# EAGLE design Power Supply Board (EAGLE 7.5.0)
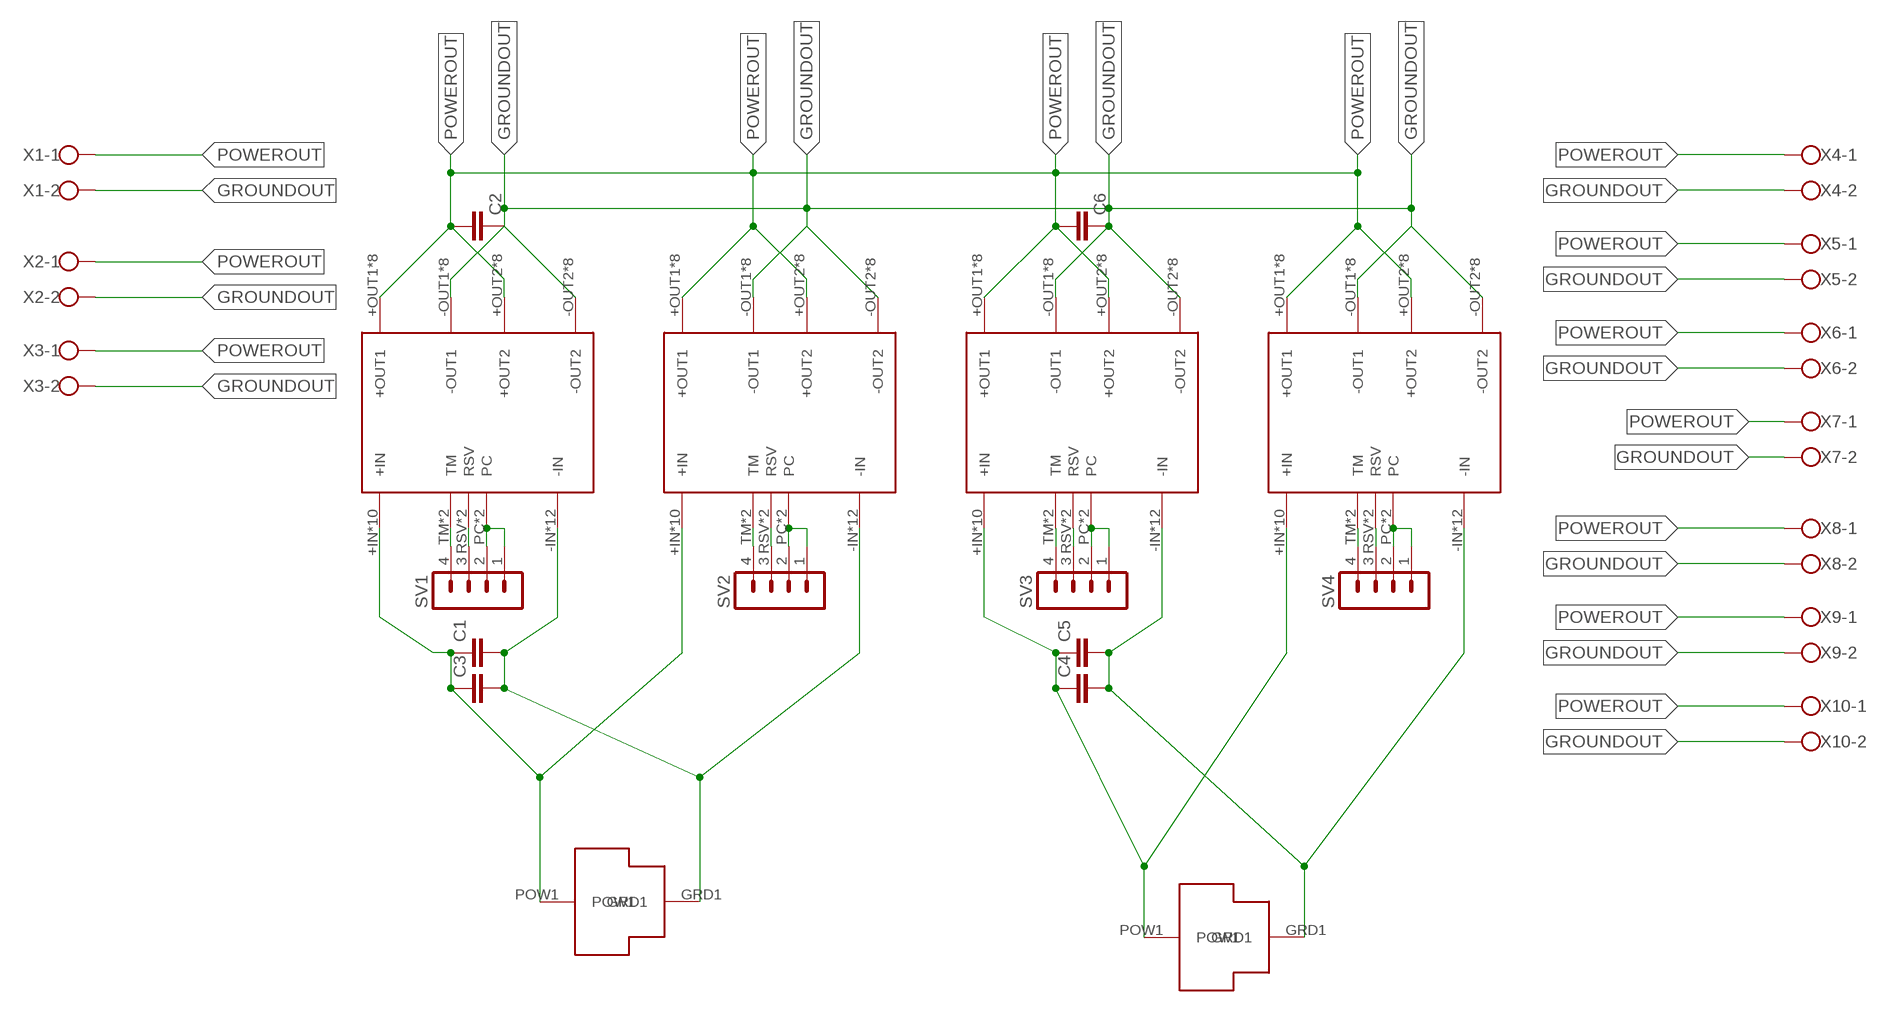
[diagram p0: schematic, sheet 1]

## Parts
C1  C2,5-3  [C2.5-3]
C2  C2,5-3  [C2.5-3]
C3  C2,5-3  [C2.5-3]
C4  C2,5-3  [C2.5-3]
C5  C2,5-3  [C2.5-3]
C6  C2,5-3  [C2.5-3]
SV1  MA04-1  [MA04-1]
SV2  MA04-1  [MA04-1]
SV3  MA04-1  [MA04-1]
SV4  MA04-1  [MA04-1]
U$3  MOLEXMEGAFIT  [MOLEXMEGAFIT]
U$9  MOLEXMEGAFIT  [MOLEXMEGAFIT]
VC1  VOLTAGECONVERTER  [VOLTAGECONVERTER]
VC2  VOLTAGECONVERTER  [VOLTAGECONVERTER]
VC3  VOLTAGECONVERTER  [VOLTAGECONVERTER]
VC4  VOLTAGECONVERTER  [VOLTAGECONVERTER]
X1  W237-102  [W237-102]
X2  W237-102  [W237-102]
X3  W237-102  [W237-102]
X4  W237-102  [W237-102]
X5  W237-102  [W237-102]
X6  W237-102  [W237-102]
X7  W237-102  [W237-102]
X8  W237-102  [W237-102]
X9  W237-102  [W237-102]
X10  W237-102  [W237-102]

## Nets
GROUNDIN: C1.2 C3.2 C4.2 C5.2 U$3.GRD1 U$9.GRD1 VC1.-IN VC1.-IN@0(-IN) VC1.-IN@1(-IN) VC1.-IN@2(-IN) VC1.-IN@3(-IN) VC1.-IN@4(-IN) VC1.-IN@5(-IN) VC1.-IN@6(-IN) VC1.-IN@7(-IN) VC1.-IN@8(-IN) VC1.-IN@9(-IN) VC1.-IN@10(-IN) VC2.-IN VC2.-IN@0(-IN) VC2.-IN@1(-IN) VC2.-IN@2(-IN) VC2.-IN@3(-IN) VC2.-IN@4(-IN) VC2.-IN@5(-IN) VC2.-IN@6(-IN) VC2.-IN@7(-IN) VC2.-IN@8(-IN) VC2.-IN@9(-IN) VC2.-IN@10(-IN) VC3.-IN VC3.-IN@0(-IN) VC3.-IN@1(-IN) VC3.-IN@2(-IN) VC3.-IN@3(-IN) VC3.-IN@4(-IN) VC3.-IN@5(-IN) VC3.-IN@6(-IN) VC3.-IN@7(-IN) VC3.-IN@8(-IN) VC3.-IN@9(-IN) VC3.-IN@10(-IN) VC4.-IN VC4.-IN@0(-IN) VC4.-IN@1(-IN) VC4.-IN@2(-IN) VC4.-IN@3(-IN) VC4.-IN@4(-IN) VC4.-IN@5(-IN) VC4.-IN@6(-IN) VC4.-IN@7(-IN) VC4.-IN@8(-IN) VC4.-IN@9(-IN) VC4.-IN@10(-IN)
GROUNDOUT: C2.1 C6.1 VC1.-OUT1 VC1.-OUT1@1(-OUT1) VC1.-OUT1@2(-OUT1) VC1.-OUT1@3(-OUT1) VC1.-OUT1@4(-OUT1) VC1.-OUT1@5(-OUT1) VC1.-OUT1@6(-OUT1) VC1.-OUT1@7(-OUT1) VC1.-OUT2 VC1.-OUT2@1(-OUT2) VC1.-OUT2@2(-OUT2) VC1.-OUT2@3(-OUT2) VC1.-OUT2@4(-OUT2) VC1.-OUT2@5(-OUT2) VC1.-OUT2@6(-OUT2) VC1.-OUT2@7(-OUT2) VC2.-OUT1 VC2.-OUT1@1(-OUT1) VC2.-OUT1@2(-OUT1) VC2.-OUT1@3(-OUT1) VC2.-OUT1@4(-OUT1) VC2.-OUT1@5(-OUT1) VC2.-OUT1@6(-OUT1) VC2.-OUT1@7(-OUT1) VC2.-OUT2 VC2.-OUT2@1(-OUT2) VC2.-OUT2@2(-OUT2) VC2.-OUT2@3(-OUT2) VC2.-OUT2@4(-OUT2) VC2.-OUT2@5(-OUT2) VC2.-OUT2@6(-OUT2) VC2.-OUT2@7(-OUT2) VC3.-OUT1 VC3.-OUT1@1(-OUT1) VC3.-OUT1@2(-OUT1) VC3.-OUT1@3(-OUT1) VC3.-OUT1@4(-OUT1) VC3.-OUT1@5(-OUT1) VC3.-OUT1@6(-OUT1) VC3.-OUT1@7(-OUT1) VC3.-OUT2 VC3.-OUT2@1(-OUT2) VC3.-OUT2@2(-OUT2) VC3.-OUT2@3(-OUT2) VC3.-OUT2@4(-OUT2) VC3.-OUT2@5(-OUT2) VC3.-OUT2@6(-OUT2) VC3.-OUT2@7(-OUT2) VC4.-OUT1 VC4.-OUT1@1(-OUT1) VC4.-OUT1@2(-OUT1) VC4.-OUT1@3(-OUT1) VC4.-OUT1@4(-OUT1) VC4.-OUT1@5(-OUT1) VC4.-OUT1@6(-OUT1) VC4.-OUT1@7(-OUT1) VC4.-OUT2 VC4.-OUT2@1(-OUT2) VC4.-OUT2@2(-OUT2) VC4.-OUT2@3(-OUT2) VC4.-OUT2@4(-OUT2) VC4.-OUT2@5(-OUT2) VC4.-OUT2@6(-OUT2) VC4.-OUT2@7(-OUT2) X1.2 X2.2 X3.2 X4.2 X5.2 X6.2 X7.2 X8.2 X9.2 X10.2
N$2: SV1.3 VC1.RSV VC1.RSV@1(RSV)
N$5: SV2.3 VC2.RSV VC2.RSV@1(RSV)
N$8: SV3.3 VC3.RSV VC3.RSV@1(RSV)
N$11: SV4.3 VC4.RSV VC4.RSV@1(RSV)
PC1: SV1.1 SV1.2 VC1.PC VC1.PC21(PC)
PC2: SV2.1 SV2.2 VC2.PC VC2.PC21(PC)
PC3: SV3.1 SV3.2 VC3.PC VC3.PC21(PC)
PC4: SV4.1 SV4.2 VC4.PC VC4.PC21(PC)
POWERIN12: C1.1 C3.1 U$3.POW1 VC1.+IN VC1.+IN@1(+IN) VC1.+IN@2(+IN) VC1.+IN@3(+IN) VC1.+IN@4(+IN) VC1.+IN@5(+IN) VC1.+IN@6(+IN) VC1.+IN@7(+IN) VC1.+IN@8(+IN) VC1.+IN@9(+IN) VC2.+IN VC2.+IN@1(+IN) VC2.+IN@2(+IN) VC2.+IN@3(+IN) VC2.+IN@4(+IN) VC2.+IN@5(+IN) VC2.+IN@6(+IN) VC2.+IN@7(+IN) VC2.+IN@8(+IN) VC2.+IN@9(+IN)
POWERIN34: C4.1 C5.1 U$9.POW1 VC3.+IN VC3.+IN@1(+IN) VC3.+IN@2(+IN) VC3.+IN@3(+IN) VC3.+IN@4(+IN) VC3.+IN@5(+IN) VC3.+IN@6(+IN) VC3.+IN@7(+IN) VC3.+IN@8(+IN) VC3.+IN@9(+IN) VC4.+IN VC4.+IN@1(+IN) VC4.+IN@2(+IN) VC4.+IN@3(+IN) VC4.+IN@4(+IN) VC4.+IN@5(+IN) VC4.+IN@6(+IN) VC4.+IN@7(+IN) VC4.+IN@8(+IN) VC4.+IN@9(+IN)
POWEROUT: C2.2 C6.2 VC1.+OUT1 VC1.+OUT1@1(+OUT1) VC1.+OUT1@2(+OUT1) VC1.+OUT1@3(+OUT1) VC1.+OUT1@4(+OUT1) VC1.+OUT1@5(+OUT1) VC1.+OUT1@6(+OUT1) VC1.+OUT1@7(+OUT1) VC1.+OUT2 VC1.+OUT2@1(+OUT2) VC1.+OUT2@2(+OUT2) VC1.+OUT2@3(+OUT2) VC1.+OUT2@4(+OUT2) VC1.+OUT2@5(+OUT2) VC1.+OUT2@6(+OUT2) VC1.+OUT2@7(+OUT2) VC2.+OUT1 VC2.+OUT1@1(+OUT1) VC2.+OUT1@2(+OUT1) VC2.+OUT1@3(+OUT1) VC2.+OUT1@4(+OUT1) VC2.+OUT1@5(+OUT1) VC2.+OUT1@6(+OUT1) VC2.+OUT1@7(+OUT1) VC2.+OUT2 VC2.+OUT2@1(+OUT2) VC2.+OUT2@2(+OUT2) VC2.+OUT2@3(+OUT2) VC2.+OUT2@4(+OUT2) VC2.+OUT2@5(+OUT2) VC2.+OUT2@6(+OUT2) VC2.+OUT2@7(+OUT2) VC3.+OUT1 VC3.+OUT1@1(+OUT1) VC3.+OUT1@2(+OUT1) VC3.+OUT1@3(+OUT1) VC3.+OUT1@4(+OUT1) VC3.+OUT1@5(+OUT1) VC3.+OUT1@6(+OUT1) VC3.+OUT1@7(+OUT1) VC3.+OUT2 VC3.+OUT2@1(+OUT2) VC3.+OUT2@2(+OUT2) VC3.+OUT2@3(+OUT2) VC3.+OUT2@4(+OUT2) VC3.+OUT2@5(+OUT2) VC3.+OUT2@6(+OUT2) VC3.+OUT2@7(+OUT2) VC4.+OUT1 VC4.+OUT1@1(+OUT1) VC4.+OUT1@2(+OUT1) VC4.+OUT1@3(+OUT1) VC4.+OUT1@4(+OUT1) VC4.+OUT1@5(+OUT1) VC4.+OUT1@6(+OUT1) VC4.+OUT1@7(+OUT1) VC4.+OUT2 VC4.+OUT2@1(+OUT2) VC4.+OUT2@2(+OUT2) VC4.+OUT2@3(+OUT2) VC4.+OUT2@4(+OUT2) VC4.+OUT2@5(+OUT2) VC4.+OUT2@6(+OUT2) VC4.+OUT2@7(+OUT2) X1.1 X2.1 X3.1 X4.1 X5.1 X6.1 X7.1 X8.1 X9.1 X10.1
TM1: SV1.4 VC1.TM VC1.TM@1(TM)
TM2: SV2.4 VC2.TM VC2.TM@1(TM)
TM3: SV3.4 VC3.TM VC3.TM@1(TM)
TM4: SV4.4 VC4.TM VC4.TM@1(TM)

## Library data of the parts
C1-C6 = capacitor-wima:C: CAPACITOR naming: grid - package width
SV1-SV4 = con-lstb:MA04-1: PIN HEADER; OC_FARNELL: unknown; OC_NEWARK: unknown
U$3 U$9 = MolexMegaFIT 2circuit:MOLEXMEGAFIT
VC1-VC4 = Voltage Converter Pins:VOLTAGECONVERTER
X1-X10 = con-wago-500:W237-102: WAGO SCREW CLAMP; MPN: 237-102; OC_FARNELL: unknown; OC_NEWARK: 70K9898

## Board
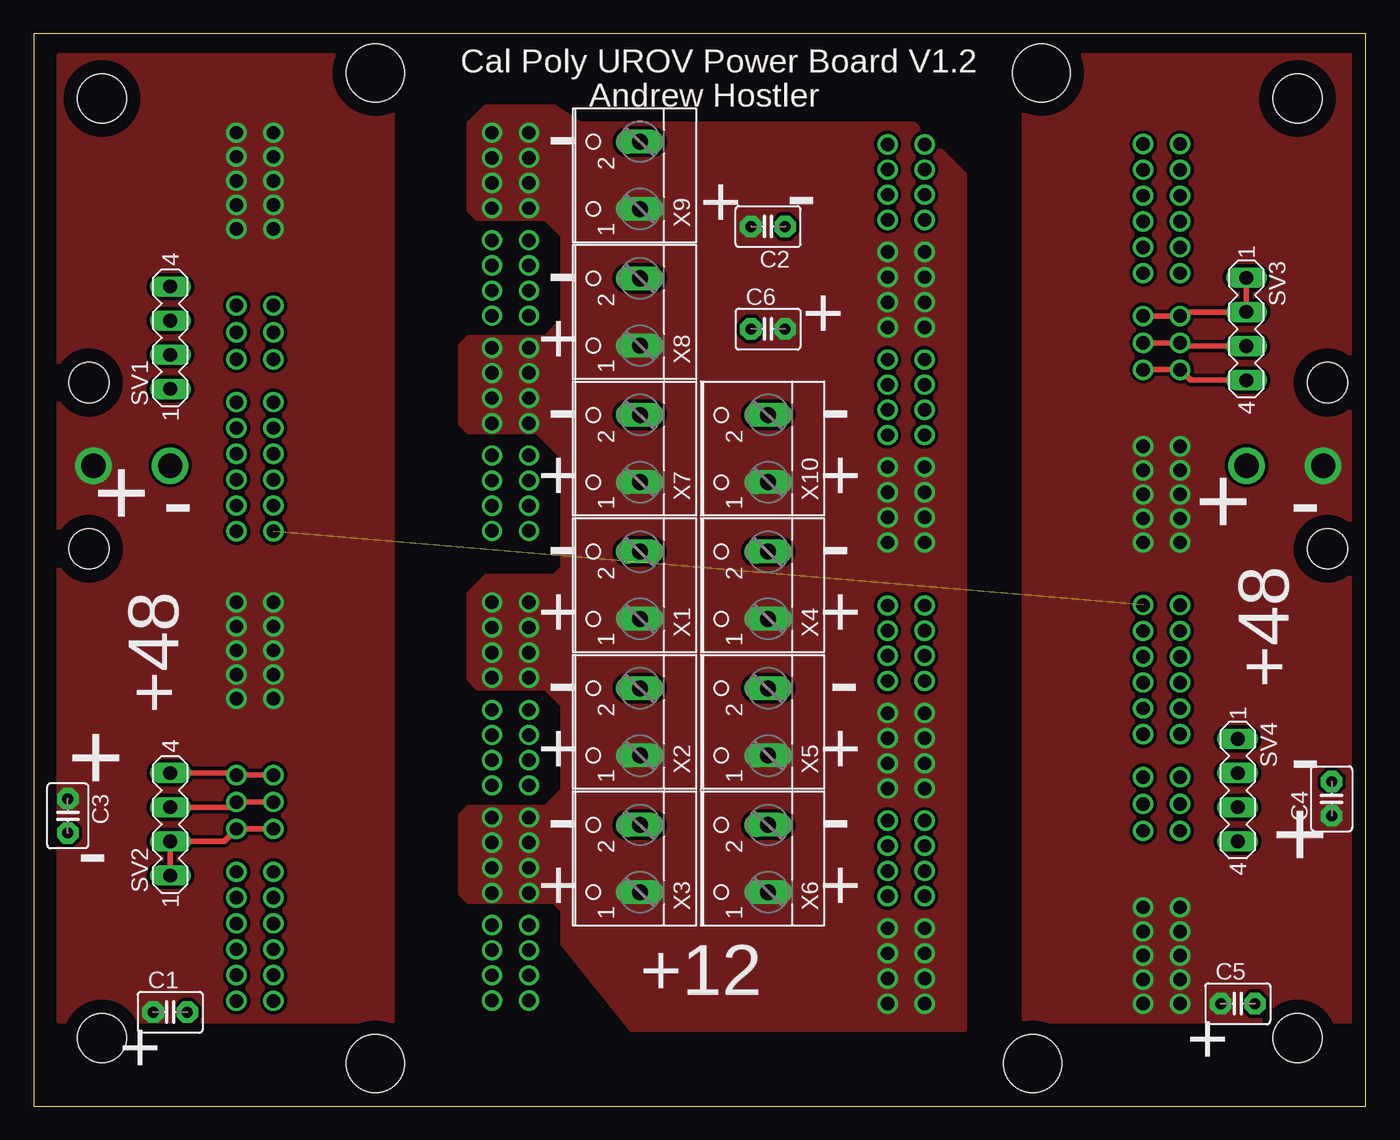
[diagram p1: board, top side]
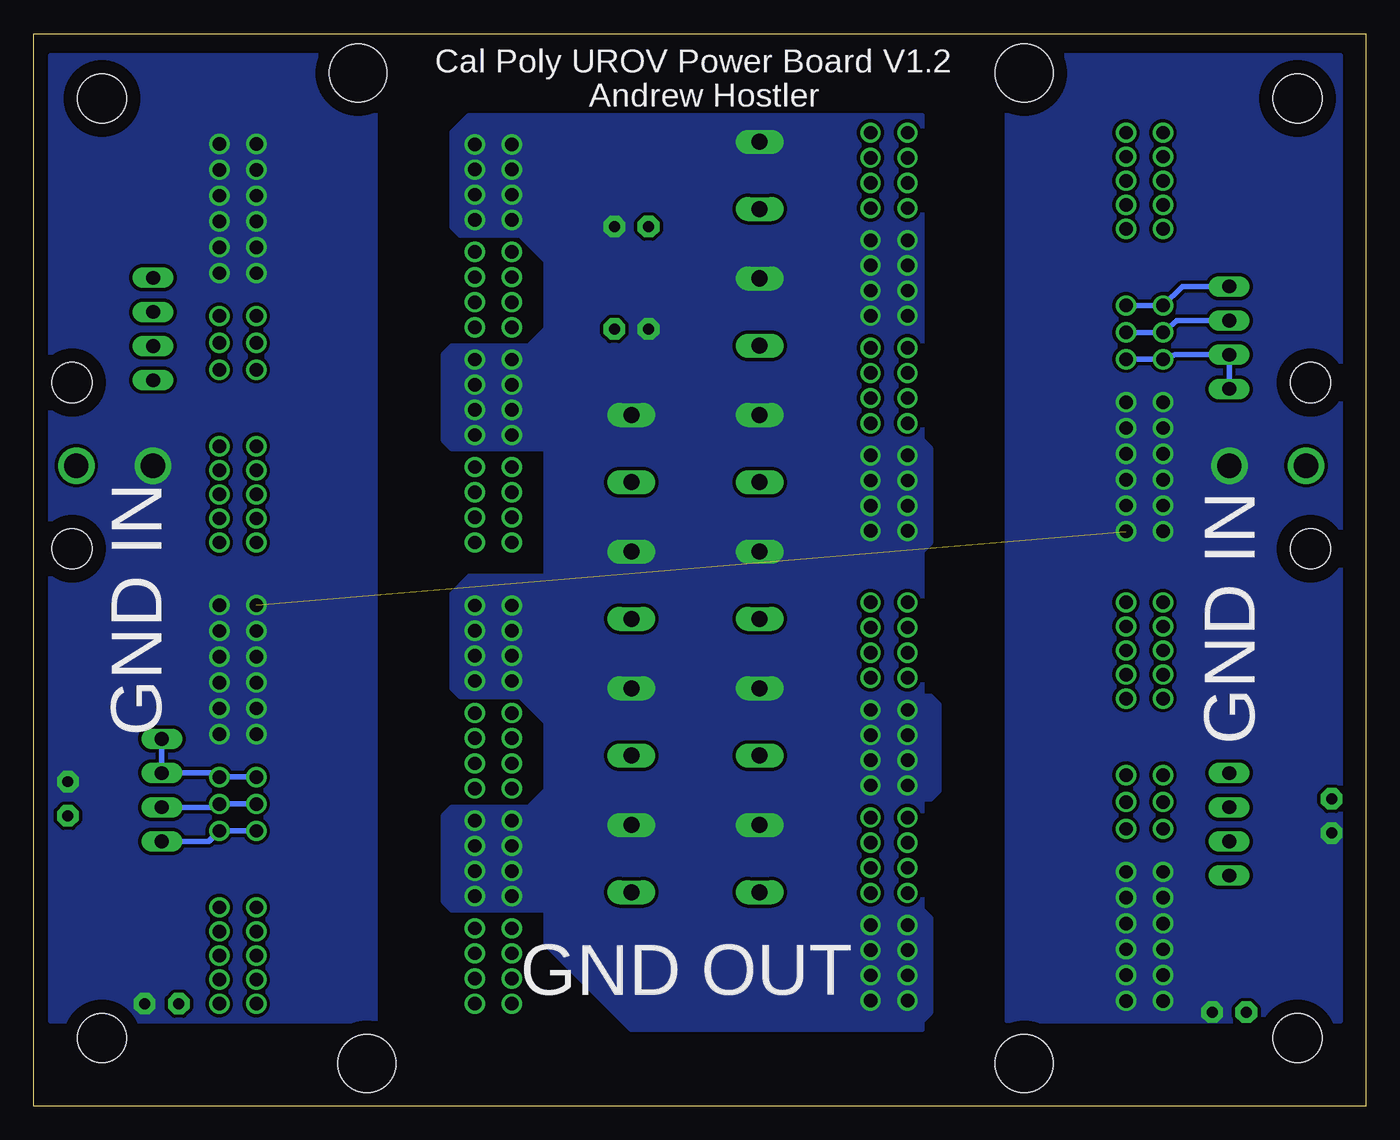
[diagram p2: board, bottom side, seen from below]

Size 99.06 x 79.76 mm. Coordinates in mm from the lower left corner, seen from the top.
Outline: 0,0 99.06,0 99.06,79.76 0,79.76 0,0
Copper layers (1*16): Top 0.035mm / dielectric 1.5mm / Bottom 0.035mm
Design rules "default *": minimum track width 10mil, minimum drill 24mil, track to track 10mil, track to pad 20mil, pad to pad 8mil, via to via 8mil, smd to smd 8mil, copper to edge 40mil, drill to drill 8mil, minimum pad ring 10mil, minimum via ring 8mil, stop-mask expansion 4mil, vias tented up to drill 0mil, thermal gap 10mil
Holes 3.66 mm at 5.08,74.93 5.08,5.08 93.98,74.93 93.98,5.08
Holes 4.32 mm at 25.4,3.17 74.3,3.17 74.93,76.83 25.4,76.83

### Footprints (pad centres in the part's own frame; a part is rotated, then mirrored left to right if it is on the bottom)
C2.5-3 = drill 0.813 pad 1.6 octagon: 1 -1.27,0; 2 1.27,0
MA04-1 = drill 1.016 long: 1 -3.81,0; 2 -1.27,0; 3 1.27,0; 4 3.81,0
MOLEXMEGAFIT = drill 1.8: GRD1 0,-5.7; POW1 0,0 | hole 3: -6.18,0.33; 6.18,0.33
VOLTAGECONVERTER = drill 0.99 pad 1.5: +IN -19,0; +IN@1 -19,-1.79; +IN@2 -19,-3.58; +IN@3 -19,-5.37; +IN@4 -19,-7.16; +IN@5 -21.75,0; +IN@6 -21.75,-1.79; +IN@7 -21.75,-3.58; +IN@8 -21.75,-5.37; +IN@9 -21.75,-7.16; +OUT1 0,0; +OUT1@1 0,-1.87; +OUT1@2 0,-3.74; +OUT1@3 0,-5.61; +OUT1@4 -2.75,0; +OUT1@5 -2.75,-1.87; +OUT1@6 -2.75,-3.74; +OUT1@7 -2.75,-5.61; +OUT2 0,-16; +OUT2@1 0,-17.87; +OUT2@2 0,-19.74; +OUT2@3 0,-21.61; +OUT2@4 -2.75,-16; +OUT2@5 -2.75,-17.87; +OUT2@6 -2.75,-19.74; +OUT2@7 -2.75,-21.61; -IN -19,-20.04; -IN@0 -21.75,-27.72; -IN@1 -19,-21.96; -IN@2 -19,-23.88; -IN@3 -19,-25.8; -IN@4 -19,-27.72; -IN@5 -19,-29.64; -IN@6 -21.75,-20.04; -IN@7 -21.75,-21.96; -IN@8 -21.75,-23.88; -IN@9 -21.75,-25.8; -IN@10 -21.75,-29.64; -OUT1 0,-8; -OUT1@1 0,-9.87; -OUT1@2 0,-11.74; -OUT1@3 0,-13.61; -OUT1@4 -2.75,-8; -OUT1@5 -2.75,-9.87; -OUT1@6 -2.75,-11.74; -OUT1@7 -2.75,-13.61; -OUT2 0,-24; -OUT2@1 0,-25.87; -OUT2@2 0,-27.74; -OUT2@3 0,-29.61; -OUT2@4 -2.75,-24; -OUT2@5 -2.75,-25.87; -OUT2@6 -2.75,-27.74; -OUT2@7 -2.75,-29.61; PC -21.75,-16.85; PC21 -19,-16.85; RSV -21.75,-14.85; RSV@1 -19,-14.85; TM -21.75,-12.85; TM@1 -19,-12.85
W237-102 = drill 1.194 long: 1 -2.5,-1.27; 2 2.5,-1.27

### Placement (x,y rotation side)
C1  10.16,6.99 0 top
C2  54.61,65.41 180 top
C3  2.54,21.59 270 top
C4  96.52,22.86 90 top
C5  89.53,7.62 0 top
C6  54.61,57.78 0 top
SV1  10.16,57.15 90 top
SV2  10.16,20.95 90 top
SV3  90.17,57.78 270 top
SV4  89.53,23.5 270 top
U$3  4.45,47.62 90 top
U$9  95.89,47.62 270 top
VC1  36.83,72.39 0 top
VC2  36.83,37.47 0 top
VC3  63.5,41.91 180 top
VC4  63.5,7.62 180 top
X1  43.81,38.73 90 top
X2  43.81,28.57 90 top
X3  43.81,18.41 90 top
X4  53.34,38.73 90 top
X5  53.34,28.57 90 top
X6  53.34,18.41 90 top
X7  43.81,48.9 90 top
X8  43.81,59.05 90 top
X9  43.81,69.22 90 top
X10  53.34,48.9 90 top

### Tracks (layer width: path | path; a pad name or v marks a point on that pad's centre or on a via)
GROUNDIN  (1 unrouted)
  pour Bottom (no thermals): 73.66,78.11 97.79,78.11 97.79,6.35 73.66,6.35
  pour Bottom (no thermals): 1.91,78.11 26.67,78.11 26.67,6.35 1.91,6.35
GROUNDOUT
  pour Bottom (no thermals): 32.38,41.91 32.38,48.9 33.02,49.53 45.09,56.52 48.26,56.52 49.53,55.24 49.53,48.26 48.26,46.35 47.62,46.35 45.72,45.09 44.45,44.45 41.91,41.91 39.37,40.64 33.66,40.64
  pour Bottom (no thermals): 48.9,73.66 33.02,73.66 33.02,5.71 54.61,5.71 60.96,12.06 60.96,73.66
  pour Bottom (no thermals): 67.94,72.39 67.94,65.41 67.31,64.77 62.87,64.77 60.96,62.87 60.96,57.78 62.23,56.52 67.94,56.52 68.58,55.88 68.58,49.53 67.94,48.9 60.96,48.9 57.15,52.07 55.24,57.78 52.07,57.78 50.8,59.05 50.8,66.04 52.07,67.94 52.07,69.85 53.98,70.48 55.88,69.85 58.42,72.39 60.96,73.66 66.67,73.66
  pour Bottom (no thermals): 67.94,38.1 67.94,31.11 67.31,30.48 62.87,30.48 60.96,28.57 60.96,23.5 62.23,22.23 67.94,22.23 68.58,21.59 68.58,15.24 67.94,14.61 60.96,14.61 57.15,17.78 55.24,23.5 53.98,23.5 52.7,24.77 52.7,31.75 53.98,33.66 54.61,33.66 56.52,34.92 55.88,35.56 58.42,38.1 60.96,39.37 66.67,39.37
  pour Bottom (no thermals): 32.38,6.99 32.38,13.97 33.02,14.61 37.47,14.61 39.37,16.51 39.37,21.59 38.1,22.86 32.38,22.86 31.75,23.5 31.75,29.84 32.38,30.48 39.37,30.48 43.18,27.3 45.09,21.59 48.26,21.59 49.53,20.32 49.53,13.34 48.26,11.43 47.62,11.43 45.72,10.16 47.62,9.53 45.09,5.71 33.66,5.71
N$2
  Bottom 0.406: SV1.3 14.05,58.42 VC1.RSV VC1.RSV@1
N$5
  Top 0.406: VC2.RSV@1 VC2.RSV 14.69,22.23 SV2.3
N$8
  Top 0.406: SV3.3 85.5,56.52 VC3.RSV VC3.RSV@1
N$11
  Bottom 0.406: VC4.RSV@1 VC4.RSV 85.5,22.23 SV4.3
PC1
  Bottom 0.406: VC1.PC21 VC1.PC 14.15,55.88 SV1.2 SV1.1
PC2
  Top 0.406: VC2.PC21 VC2.PC 14.15,19.68 SV2.2 SV2.1
PC3
  Top 0.406: VC3.PC21 VC3.PC 85.55,59.05 SV3.2 SV3.1
PC4
  Bottom 0.406: VC4.PC21 VC4.PC 85.55,24.77 SV4.2 SV4.1
POWERIN12
  pour Top (no thermals): 1.91,78.11 26.67,78.11 26.67,6.35 1.91,6.35
POWERIN34
  pour Top (no thermals): 73.66,78.11 98.42,78.11 98.42,6.35 73.66,6.35
POWEROUT
  pour Top (no thermals): 33.66,74.3 32.38,73.03 32.38,66.67 33.02,66.04 38.1,66.04 39.37,64.77 39.37,58.42 38.1,57.15 32.38,57.15 31.75,56.52 31.75,50.8 32.38,50.16 37.47,50.16 39.37,48.26 45.09,48.26 45.09,57.78 47.62,57.78 47.62,68.58 45.72,68.58 44.45,69.85 40.64,73.03 38.73,74.3
  pour Top (no thermals): 65.41,73.03 69.22,69.22 69.22,5.71 44.45,5.71 39.37,12.06 39.37,73.03
  pour Top (no thermals): 66.67,40.01 67.94,41.27 67.94,47.62 67.31,48.26 62.23,48.26 60.96,49.53 60.96,55.24 62.23,57.15 67.94,57.15 68.58,57.78 68.58,63.5 67.94,64.14 56.52,64.14 55.24,62.87 55.24,57.78 53.98,56.52 50.8,56.52 50.8,45.72 52.7,45.72 52.7,38.73 60.33,38.73 61.59,40.01
  pour Top (no thermals): 66.67,5.71 67.94,6.99 67.94,13.34 67.31,13.97 62.23,13.97 60.96,15.24 60.96,20.95 62.23,22.86 67.94,22.86 68.58,23.5 68.58,29.21 67.94,29.84 61.59,29.84 60.96,30.48 55.24,30.48 55.24,22.23 52.7,22.23 52.7,11.43 54.61,11.43 55.88,7.62 53.34,5.71
  pour Top (no thermals): 33.66,39.37 32.38,38.1 32.38,31.75 33.02,31.11 38.1,31.11 39.37,29.84 39.37,23.5 38.1,22.23 32.38,22.23 31.75,21.59 31.75,15.88 32.38,15.24 38.73,15.24 40.01,13.97 45.09,17.78 45.09,22.86 47.62,22.86 47.62,40.01 39.37,40.01 38.73,39.37
TM1
  Bottom 0.406: SV1.4 13.66,60.96 VC1.TM VC1.TM@1
TM2
  Top 0.406: SV2.4 14.93,24.77 VC2.TM VC2.TM@1
TM3
  Top 0.406: SV3.4 86.03,53.98 VC3.TM VC3.TM@1
TM4
  Bottom 0.406: VC4.TM@1 VC4.TM 86.03,19.68 SV4.4

### Text on the board
tPlace: Cal Poly UROV Power Board V1.2 | Andrew Hostler | +48 | +48 | +12
bPlace: Cal Poly UROV Power Board V1.2 | Andrew Hostler | GND IN | GND IN | GND OUT
tNames: - | + | - | - | + | + | - | - | + | + | + | - | + | - | - | - | + | + | - | - | + | + | + | - | - | - | + | - | + | + | + | +